# EAGLE design pintu (EAGLE 7.6.0)
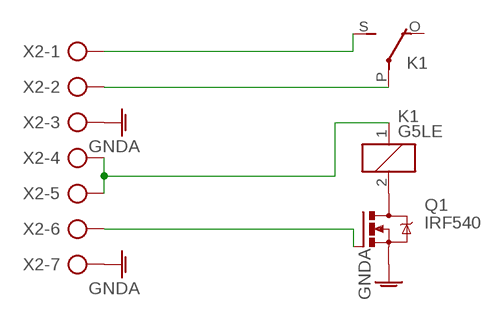
[diagram p0: schematic, sheet 1]

## Parts
K1  G5LE  [G5LE]
Q1  IRF540  [TO220BV]
X2  AK300/7  [AK300/7]

## Nets
12V: K1.1 X2.4 X2.5
GNDA: Q1.S X2.3 X2.7
L2: K1.P(2:P) X2.2
N$2: K1.2 Q1.D
N$3: Q1.G X2.6
N$4: K1.S(2:S) X2.1
Unconnected: K1.O(2:O)

## Library data of the parts
K1 = relay:G5LE: RELAY 1 x switch, 10 A/120 V AC, 8 A/30 V DC, Omron; OC_FARNELL: unknown; OC_NEWARK: unknown
Q1 = transistor-power:IRF540: HEXFET Power MOSFET
X2 = con-ptr500:AK300/7: CONNECTOR; OC_FARNELL: unknown; OC_NEWARK: unknown

## Board
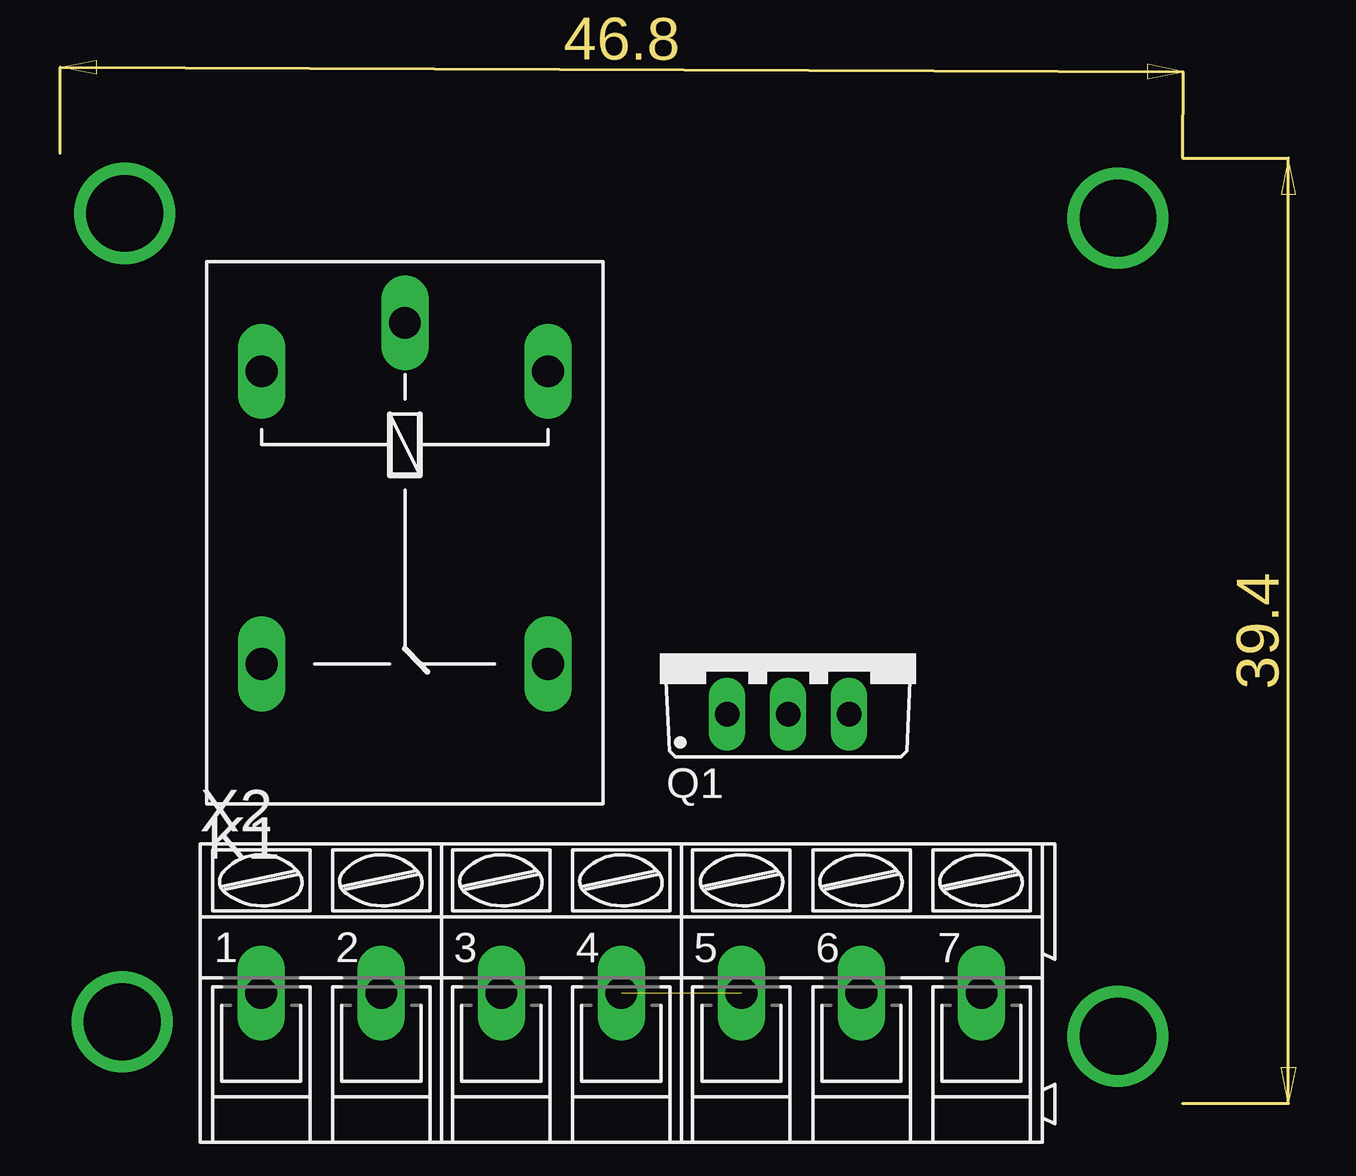
[diagram p1: board, top side]
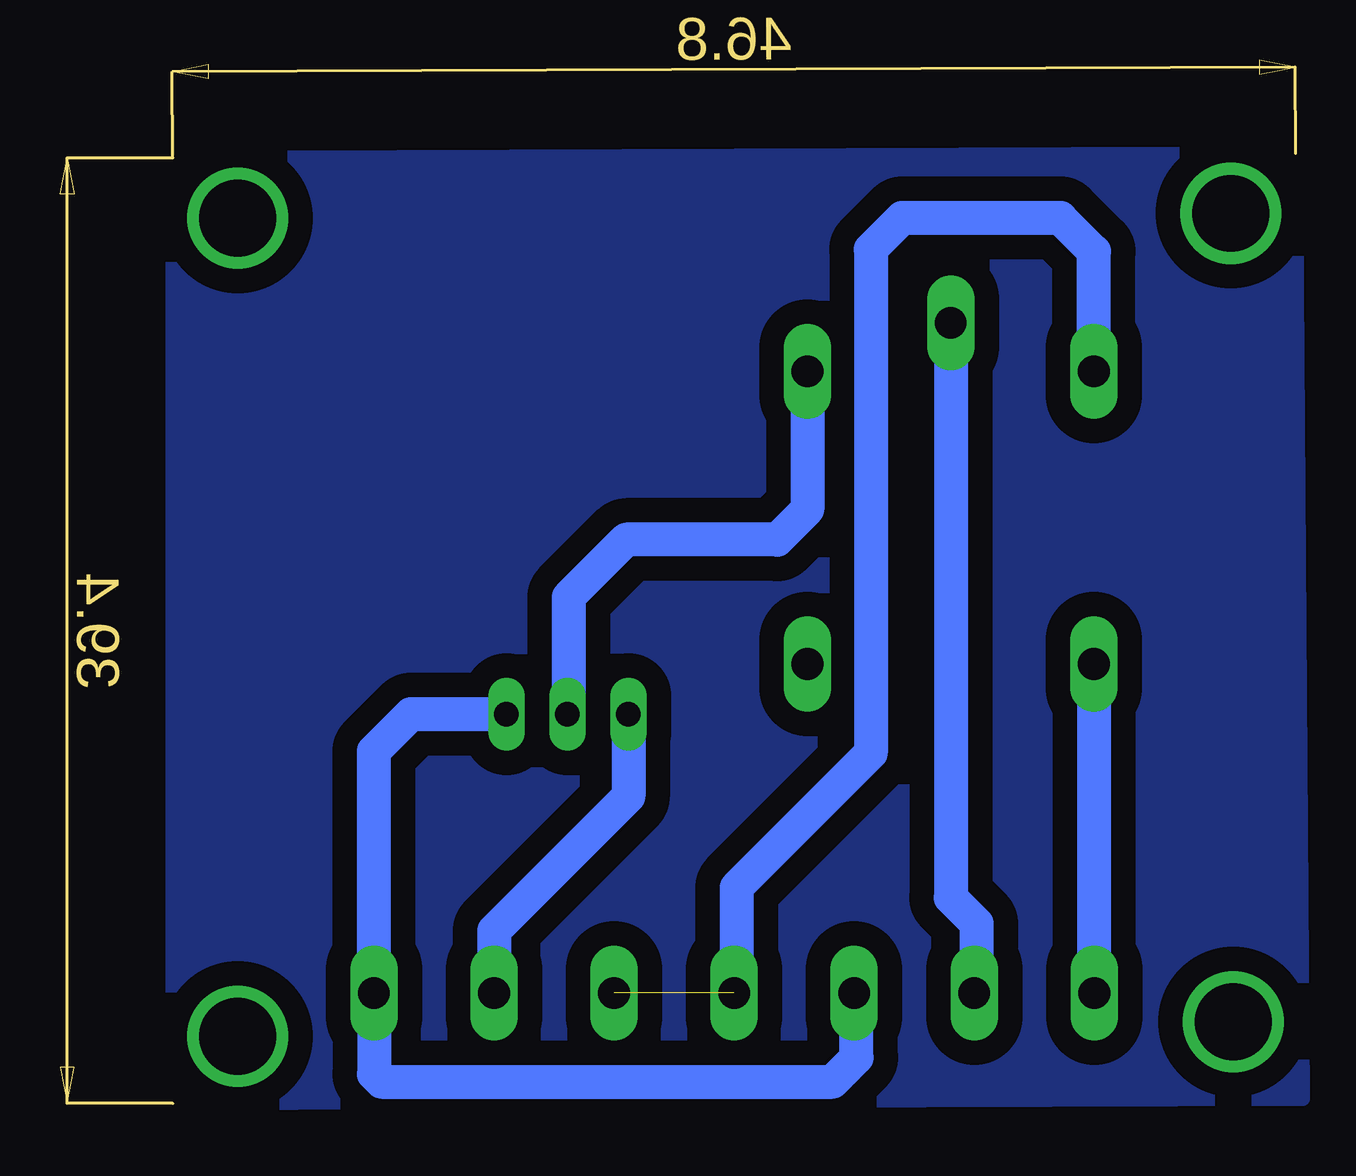
[diagram p2: board, bottom side, seen from below]

Size 51.5 x 43.49 mm. Coordinates in mm from the lower left corner, seen from the top.
Copper layers (1*16): Top 0.035mm / dielectric 1.5mm / Bottom 0.035mm
Design rules "default": minimum track width 10mil, minimum drill 24mil, track to track 8mil, track to pad 8mil, pad to pad 8mil, via to via 8mil, smd to smd 8mil, copper to edge 40mil, drill to drill 8mil, minimum pad ring 10mil, minimum via ring 8mil, stop-mask expansion 4mil, vias tented up to drill 0mil, thermal gap 10mil

### Footprints (pad centres in the part's own frame; a part is rotated, then mirrored left to right if it is on the bottom)
G5LE = drill 1.321 long: 1 -7.493,-5.969; 2 -7.493,5.969; O 4.699,5.969; P -9.525,0; S 4.699,-5.969
TO220BV = drill 1.016 long: D 0,-2.54; G -2.54,-2.54; S 2.54,-2.54
AK300/7 = drill 1.321 long: 1 -15.011,0; 2 -10.008,0; 3 -5.004,0; 4 0,0; 5 5.004,0; 6 10.008,0; 7 15.011,0

### Placement (x,y rotation side)
K1  14.37,23.02 270 top
Q1  30.35,18.75 0 top
X2  23.4,4.6 0 top

### Tracks (layer width: path | path; a pad name or v marks a point on that pad's centre or on a via)
12V  (1 unrouted)
  Bottom 1.422: K1.1 8.41,35.51 9.8,36.9 16.4,36.9 17.7,35.6 17.7,14.6 23.3,9 23.3,4.7 X2.4
GNDA
  Bottom 1.422: Q1.S 36.88,16.21 38.41,14.69 X2.7 38.41,1.21 38.1,0.9 19.3,0.9 18.3,1.9 18.3,4.5 X2.3
L2
  Bottom 1.422: K1.P 14.37,8.57 13.3,7.5 13.3,4.69 X2.2
N$1
  pour Bottom (isolate 1.016): 0,39.6 46.8,39.4 46.8,0 -0.3,0.2
N$2
  Bottom 1.422: K1.2 20.34,24.76 21.6,23.5 27.9,23.5 30.3,21.1 30.3,16.27 Q1.D
N$3
  Bottom 1.422: Q1.G 27.81,12.79 33.4,7.2 X2.6
N$4
  Bottom 1.422: X2.1 8.39,18.3 K1.S
N$5  (via drill 3.2 pad 3.81)
  other vias: 44.1,36.9
N$6  (via drill 3.2 pad 3.81)
  other vias: 2.6,3.4
N$7  (via drill 3.2 pad 3.81)
  other vias: 2.7,37.1
N$8  (via drill 3.2 pad 3.81)
  other vias: 44.1,2.8